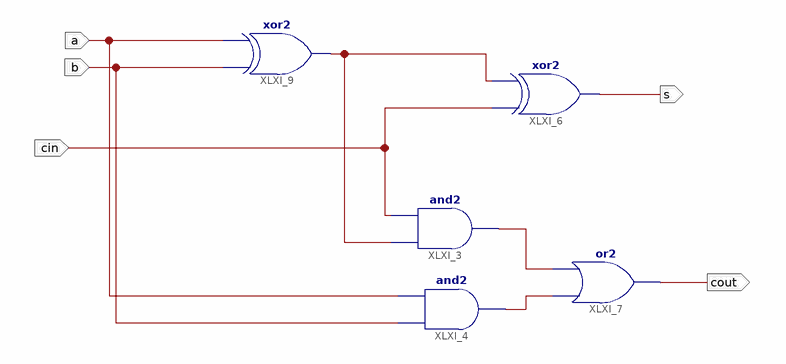
[diagram p0: schematic sheet 1]
// Xilinx ISE schematic schemat.sch (spartan3adsp) as structural Verilog: 5 symbols, 5 ports
module schemat (
  input  b,
  input  a,
  input  cin,
  output s,
  output cout
);

  wire XLXN_23, XLXN_24, XLXN_25;

  and XLXI_3 (XLXN_24, XLXN_23, cin);
  and XLXI_4 (XLXN_25, b, a);
  xor XLXI_6 (s, cin, XLXN_23);
  or XLXI_7 (cout, XLXN_25, XLXN_24);
  xor XLXI_9 (XLXN_23, b, a);
endmodule
